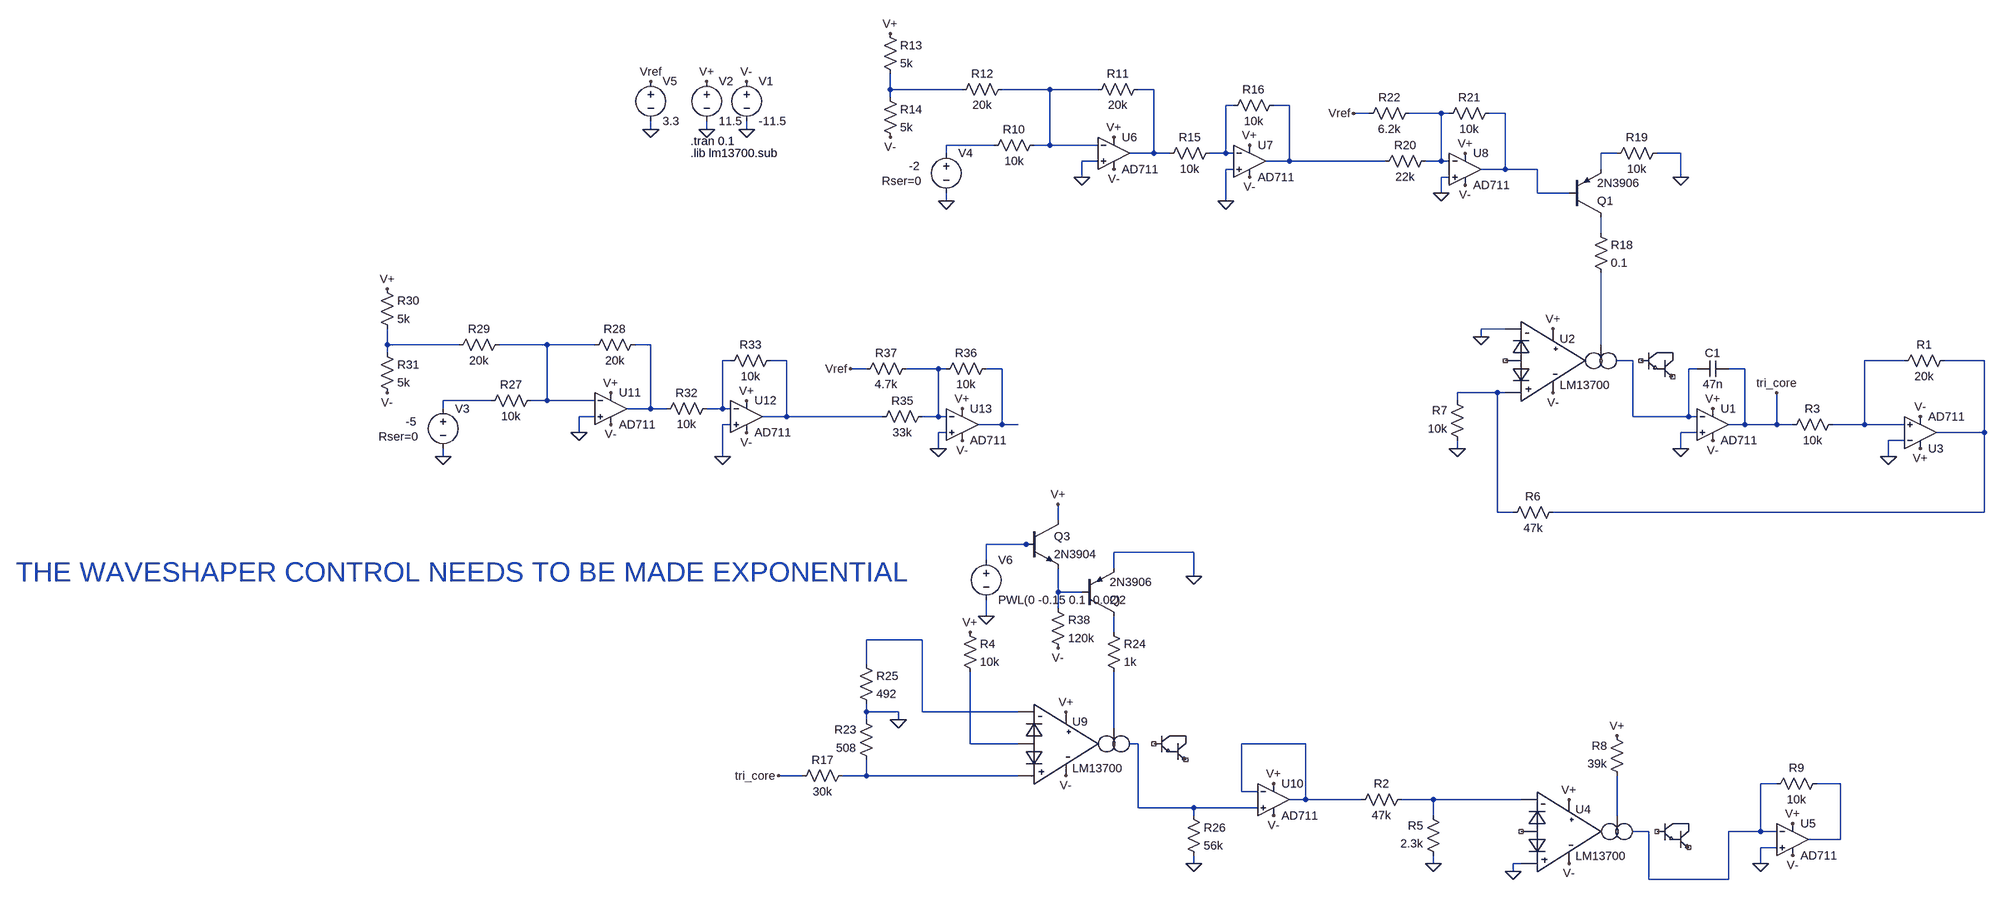
[diagram p0: schematic osc_core.asc]
osc_core.asc, the LTspice schematic file:
Version 4
SHEET 1 1972 1396
WIRE -1632 -448 -1632 -480
WIRE -1488 -448 -1632 -448
WIRE -1312 -448 -1408 -448
WIRE -1216 -448 -1312 -448
WIRE -1104 -448 -1136 -448
WIRE -1632 -432 -1632 -448
WIRE -944 -416 -960 -416
WIRE -832 -416 -864 -416
WIRE -672 -400 -704 -400
WIRE -528 -400 -592 -400
WIRE -512 -400 -528 -400
WIRE -400 -400 -432 -400
WIRE -2112 -368 -2112 -384
WIRE -2000 -368 -2000 -384
WIRE -1920 -368 -1920 -384
WIRE -1424 -336 -1520 -336
WIRE -1312 -336 -1312 -448
WIRE -1312 -336 -1344 -336
WIRE -1216 -336 -1312 -336
WIRE -1520 -320 -1520 -336
WIRE -1104 -320 -1104 -448
WIRE -1104 -320 -1152 -320
WIRE -1072 -320 -1104 -320
WIRE -960 -320 -960 -416
WIRE -960 -320 -992 -320
WIRE -944 -320 -960 -320
WIRE -176 -320 -208 -320
WIRE -48 -320 -96 -320
WIRE -1216 -304 -1248 -304
WIRE -832 -304 -832 -416
WIRE -832 -304 -880 -304
WIRE -640 -304 -832 -304
WIRE -528 -304 -528 -400
WIRE -528 -304 -560 -304
WIRE -512 -304 -528 -304
WIRE -944 -288 -960 -288
WIRE -400 -288 -400 -400
WIRE -400 -288 -448 -288
WIRE -336 -288 -400 -288
WIRE -208 -288 -208 -320
WIRE -1248 -272 -1248 -304
WIRE -512 -272 -528 -272
WIRE -48 -272 -48 -320
WIRE -528 -240 -528 -272
WIRE -336 -240 -336 -288
WIRE -272 -240 -336 -240
WIRE -1520 -224 -1520 -240
WIRE -960 -224 -960 -288
WIRE -208 -160 -208 -192
WIRE -400 32 -448 32
WIRE -448 48 -448 32
WIRE -2640 64 -2640 32
WIRE -2496 64 -2640 64
WIRE -2320 64 -2416 64
WIRE -2224 64 -2320 64
WIRE -2112 64 -2144 64
WIRE -208 64 -208 -80
WIRE -2640 80 -2640 64
WIRE -1952 96 -1968 96
WIRE -1840 96 -1872 96
WIRE -144 96 -176 96
WIRE 400 96 320 96
WIRE 560 96 480 96
WIRE -1680 112 -1712 112
WIRE -1536 112 -1600 112
WIRE -1520 112 -1536 112
WIRE -1408 112 -1440 112
WIRE -16 112 -32 112
WIRE 80 112 48 112
WIRE -416 160 -496 160
WIRE -400 160 -416 160
WIRE -2432 176 -2528 176
WIRE -2320 176 -2320 64
WIRE -2320 176 -2352 176
WIRE -2224 176 -2320 176
WIRE -496 176 -496 160
WIRE -2528 192 -2528 176
WIRE -2112 192 -2112 64
WIRE -2112 192 -2160 192
WIRE -2080 192 -2112 192
WIRE -1968 192 -1968 96
WIRE -1968 192 -2000 192
WIRE -1952 192 -1968 192
WIRE -2224 208 -2256 208
WIRE -1840 208 -1840 96
WIRE -1840 208 -1888 208
WIRE -1648 208 -1840 208
WIRE -1536 208 -1536 112
WIRE -1536 208 -1568 208
WIRE -1520 208 -1536 208
WIRE -144 208 -144 96
WIRE -32 208 -32 112
WIRE -32 208 -144 208
WIRE -16 208 -32 208
WIRE -1952 224 -1968 224
WIRE -1408 224 -1408 112
WIRE -1408 224 -1456 224
WIRE -1376 224 -1408 224
WIRE 80 224 80 112
WIRE 80 224 48 224
WIRE 144 224 144 160
WIRE 144 224 80 224
WIRE 176 224 144 224
WIRE 320 224 320 96
WIRE 320 224 256 224
WIRE 400 224 320 224
WIRE -2256 240 -2256 208
WIRE -1520 240 -1536 240
WIRE -16 240 -48 240
WIRE 560 240 560 96
WIRE 560 240 464 240
WIRE 400 256 368 256
WIRE -1536 272 -1536 240
WIRE -496 272 -496 256
WIRE -48 272 -48 240
WIRE -2528 288 -2528 272
WIRE -1968 288 -1968 224
WIRE 368 288 368 256
WIRE -416 400 -416 160
WIRE -384 400 -416 400
WIRE 560 400 560 240
WIRE 560 400 -304 400
WIRE -1296 416 -1296 384
WIRE -1360 464 -1440 464
WIRE -1344 464 -1360 464
WIRE -1024 480 -1184 480
WIRE -1440 496 -1440 464
WIRE -1184 512 -1184 480
WIRE -1024 528 -1024 480
WIRE -1296 560 -1296 512
WIRE -1248 560 -1296 560
WIRE -1296 592 -1296 560
WIRE -1440 608 -1440 576
WIRE -1184 640 -1184 608
WIRE -1568 656 -1680 656
WIRE -1680 704 -1680 656
WIRE -1680 800 -1680 784
WIRE -1616 800 -1680 800
WIRE -1568 800 -1568 656
WIRE -1376 800 -1568 800
WIRE -1680 816 -1680 800
WIRE -1616 816 -1616 800
WIRE -1184 832 -1184 720
WIRE -1472 864 -1472 720
WIRE -1376 864 -1472 864
WIRE -1136 864 -1152 864
WIRE -800 864 -928 864
WIRE -1808 928 -1856 928
WIRE -1680 928 -1680 896
WIRE -1680 928 -1728 928
WIRE -1376 928 -1680 928
WIRE 144 944 112 944
WIRE 272 944 224 944
WIRE -928 960 -928 864
WIRE -896 960 -928 960
WIRE -800 976 -800 864
WIRE -800 976 -832 976
WIRE -688 976 -800 976
WIRE -544 976 -608 976
WIRE -368 976 -544 976
WIRE -1136 992 -1136 864
WIRE -1024 992 -1136 992
WIRE -896 992 -1024 992
WIRE -1024 1008 -1024 992
WIRE -544 1008 -544 976
WIRE -176 1008 -176 928
WIRE -112 1040 -144 1040
WIRE 112 1040 112 944
WIRE 112 1040 48 1040
WIRE 144 1040 112 1040
WIRE 272 1056 272 944
WIRE 272 1056 208 1056
WIRE 144 1072 112 1072
WIRE -1024 1104 -1024 1088
WIRE -544 1104 -544 1088
WIRE -368 1104 -384 1104
WIRE 112 1104 112 1072
WIRE -384 1120 -384 1104
WIRE -112 1136 -112 1040
WIRE 48 1136 48 1040
WIRE 48 1136 -112 1136
FLAG -1920 -368 0
FLAG -2000 -368 0
FLAG -2000 -464 V+
FLAG 432 272 V+
FLAG -1920 -464 V-
FLAG 432 208 V-
FLAG -304 32 V+
FLAG -304 160 V-
FLAG -448 48 0
FLAG 368 288 0
FLAG 16 192 V+
FLAG 16 256 V-
FLAG -48 272 0
FLAG -496 272 0
FLAG 144 160 tri_core
FLAG -176 848 V+
FLAG -272 1104 V-
FLAG -272 976 V+
FLAG 176 1088 V-
FLAG 176 1024 V+
FLAG 112 1104 0
FLAG -384 1120 0
FLAG -1520 -224 0
FLAG -1184 -352 V+
FLAG -1184 -288 V-
FLAG -1248 -272 0
FLAG -1632 -352 V-
FLAG -1632 -560 V+
FLAG -912 -336 V+
FLAG -912 -272 V-
FLAG -960 -224 0
FLAG -48 -272 0
FLAG -480 -320 V+
FLAG -480 -256 V-
FLAG -528 -240 0
FLAG -704 -400 Vref
FLAG -2112 -368 0
FLAG -2112 -464 Vref
FLAG -1280 800 V+
FLAG -1280 928 V-
FLAG -1472 640 V+
FLAG -1616 816 0
FLAG -864 944 V+
FLAG -864 1008 V-
FLAG -1024 1104 0
FLAG -1856 928 tri_core
FLAG -2528 288 0
FLAG -2192 160 V+
FLAG -2192 224 V-
FLAG -2256 240 0
FLAG -2640 160 V-
FLAG -2640 -48 V+
FLAG -1920 176 V+
FLAG -1920 240 V-
FLAG -1968 288 0
FLAG -1024 528 0
FLAG -1488 192 V+
FLAG -1488 256 V-
FLAG -1536 272 0
FLAG -1712 112 Vref
FLAG -544 1104 0
FLAG -1296 384 V+
FLAG -1440 608 0
FLAG -1296 672 V-
SYMBOL voltage -1920 -480 R0
WINDOW 123 0 0 Left 0
WINDOW 39 0 0 Left 0
SYMATTR InstName V1
SYMATTR Value -11.5
SYMBOL voltage -2000 -480 R0
WINDOW 123 0 0 Left 0
WINDOW 39 0 0 Left 0
SYMATTR InstName V2
SYMATTR Value 11.5
SYMBOL LM13700 -336 16 R0
SYMATTR InstName U2
SYMBOL res 496 80 R90
WINDOW 0 0 56 VBottom 2
WINDOW 3 32 56 VTop 2
SYMATTR InstName R1
SYMATTR Value 20k
SYMBOL cap 48 96 R90
WINDOW 0 0 32 VBottom 2
WINDOW 3 32 32 VTop 2
SYMATTR InstName C1
SYMATTR Value 47n
SYMBOL res 272 208 R90
WINDOW 0 0 56 VBottom 2
WINDOW 3 32 56 VTop 2
SYMATTR InstName R3
SYMATTR Value 10k
SYMBOL res -288 384 R90
WINDOW 0 0 56 VBottom 2
WINDOW 3 32 56 VTop 2
SYMATTR InstName R6
SYMATTR Value 47k
SYMBOL res -480 272 R180
WINDOW 0 36 76 Left 2
WINDOW 3 36 40 Left 2
SYMATTR InstName R7
SYMATTR Value 10k
SYMBOL OpAmps\\AD711 16 160 R0
SYMATTR InstName U1
SYMBOL OpAmps\\AD711 432 304 M180
SYMATTR InstName U3
SYMBOL LM13700 -304 960 R0
SYMATTR InstName U4
SYMBOL res -592 960 R90
WINDOW 0 0 56 VBottom 2
WINDOW 3 32 56 VTop 2
SYMATTR InstName R2
SYMATTR Value 47k
SYMBOL res -528 1104 R180
WINDOW 0 36 76 Left 2
WINDOW 3 36 40 Left 2
SYMATTR InstName R5
SYMATTR Value 2.3k
SYMBOL res -160 944 R180
WINDOW 0 36 76 Left 2
WINDOW 3 36 40 Left 2
SYMATTR InstName R8
SYMATTR Value 39k
SYMBOL res 240 928 R90
WINDOW 0 0 56 VBottom 2
WINDOW 3 32 56 VTop 2
SYMATTR InstName R9
SYMATTR Value 10k
SYMBOL OpAmps\\AD711 176 992 R0
SYMATTR InstName U5
SYMBOL Opamps\\AD711 -1184 -384 R0
SYMATTR InstName U6
SYMBOL res -1328 -352 R90
WINDOW 0 0 56 VBottom 2
WINDOW 3 32 56 VTop 2
SYMATTR InstName R10
SYMATTR Value 10k
SYMBOL res -1120 -464 R90
WINDOW 0 0 56 VBottom 2
WINDOW 3 32 56 VTop 2
SYMATTR InstName R11
SYMATTR Value 20k
SYMBOL voltage -1520 -336 R0
WINDOW 123 0 0 Left 0
WINDOW 39 -129 72 Left 2
WINDOW 3 -75 42 Left 2
SYMATTR SpiceLine Rser=0
SYMATTR Value -2
SYMATTR InstName V4
SYMBOL res -1392 -464 R90
WINDOW 0 0 56 VBottom 2
WINDOW 3 32 56 VTop 2
SYMATTR InstName R12
SYMATTR Value 20k
SYMBOL res -1648 -576 R0
SYMATTR InstName R13
SYMATTR Value 5k
SYMBOL res -1648 -448 R0
SYMATTR InstName R14
SYMATTR Value 5k
SYMBOL Opamps\\AD711 -912 -368 R0
SYMATTR InstName U7
SYMBOL res -976 -336 R90
WINDOW 0 0 56 VBottom 2
WINDOW 3 32 56 VTop 2
SYMATTR InstName R15
SYMATTR Value 10k
SYMBOL res -848 -432 R90
WINDOW 0 0 56 VBottom 2
WINDOW 3 32 56 VTop 2
SYMATTR InstName R16
SYMATTR Value 10k
SYMBOL res -224 -176 R0
SYMATTR InstName R18
SYMATTR Value 0.1
SYMBOL pnp -272 -192 M180
SYMATTR InstName Q1
SYMATTR Value 2N3906
SYMBOL res -80 -336 R90
WINDOW 0 0 56 VBottom 2
WINDOW 3 32 56 VTop 2
SYMATTR InstName R19
SYMATTR Value 10k
SYMBOL Opamps\\AD711 -480 -352 R0
SYMATTR InstName U8
SYMBOL res -544 -320 R90
WINDOW 0 0 56 VBottom 2
WINDOW 3 32 56 VTop 2
SYMATTR InstName R20
SYMATTR Value 22k
SYMBOL res -416 -416 R90
WINDOW 0 0 56 VBottom 2
WINDOW 3 32 56 VTop 2
SYMATTR InstName R21
SYMATTR Value 10k
SYMBOL res -576 -416 R90
WINDOW 0 0 56 VBottom 2
WINDOW 3 32 56 VTop 2
SYMATTR InstName R22
SYMATTR Value 6.2k
SYMBOL voltage -2112 -480 R0
WINDOW 123 0 0 Left 0
WINDOW 39 0 0 Left 0
SYMATTR InstName V5
SYMATTR Value 3.3
SYMBOL LM13700 -1312 784 R0
SYMATTR InstName U9
SYMBOL res -1488 624 R0
SYMATTR InstName R4
SYMATTR Value 10k
SYMBOL res -1712 912 R90
WINDOW 0 0 56 VBottom 2
WINDOW 3 32 56 VTop 2
SYMATTR InstName R17
SYMATTR Value 30k
SYMBOL res -1664 912 R180
WINDOW 0 36 76 Left 2
WINDOW 3 36 40 Left 2
SYMATTR InstName R23
SYMATTR Value 508
SYMBOL res -1200 624 R0
SYMATTR InstName R24
SYMATTR Value 1k
SYMBOL res -1696 688 R0
SYMATTR InstName R25
SYMATTR Value 492
SYMBOL Opamps\\AD711 -864 912 R0
SYMATTR InstName U10
SYMBOL res -1040 992 R0
SYMATTR InstName R26
SYMATTR Value 56k
SYMBOL Opamps\\AD711 -2192 128 R0
SYMATTR InstName U11
SYMBOL res -2336 160 R90
WINDOW 0 0 56 VBottom 2
WINDOW 3 32 56 VTop 2
SYMATTR InstName R27
SYMATTR Value 10k
SYMBOL res -2128 48 R90
WINDOW 0 0 56 VBottom 2
WINDOW 3 32 56 VTop 2
SYMATTR InstName R28
SYMATTR Value 20k
SYMBOL voltage -2528 176 R0
WINDOW 123 0 0 Left 0
WINDOW 39 -129 72 Left 2
WINDOW 3 -75 42 Left 2
SYMATTR SpiceLine Rser=0
SYMATTR Value -5
SYMATTR InstName V3
SYMBOL res -2400 48 R90
WINDOW 0 0 56 VBottom 2
WINDOW 3 32 56 VTop 2
SYMATTR InstName R29
SYMATTR Value 20k
SYMBOL res -2656 -64 R0
SYMATTR InstName R30
SYMATTR Value 5k
SYMBOL res -2656 64 R0
SYMATTR InstName R31
SYMATTR Value 5k
SYMBOL Opamps\\AD711 -1920 144 R0
SYMATTR InstName U12
SYMBOL res -1984 176 R90
WINDOW 0 0 56 VBottom 2
WINDOW 3 32 56 VTop 2
SYMATTR InstName R32
SYMATTR Value 10k
SYMBOL res -1856 80 R90
WINDOW 0 0 56 VBottom 2
WINDOW 3 32 56 VTop 2
SYMATTR InstName R33
SYMATTR Value 10k
SYMBOL pnp -1248 608 M180
SYMATTR InstName Q2
SYMATTR Value 2N3906
SYMBOL Opamps\\AD711 -1488 160 R0
SYMATTR InstName U13
SYMBOL res -1552 192 R90
WINDOW 0 0 56 VBottom 2
WINDOW 3 32 56 VTop 2
SYMATTR InstName R35
SYMATTR Value 33k
SYMBOL res -1424 96 R90
WINDOW 0 0 56 VBottom 2
WINDOW 3 32 56 VTop 2
SYMATTR InstName R36
SYMATTR Value 10k
SYMBOL res -1584 96 R90
WINDOW 0 0 56 VBottom 2
WINDOW 3 32 56 VTop 2
SYMATTR InstName R37
SYMATTR Value 4.7k
SYMBOL npn -1360 416 R0
SYMATTR InstName Q3
SYMATTR Value 2N3904
SYMBOL res -1312 576 R0
SYMATTR InstName R38
SYMATTR Value 120k
SYMBOL voltage -1440 480 R0
WINDOW 123 0 0 Left 0
WINDOW 39 0 0 Left 0
SYMATTR InstName V6
SYMATTR Value PWL(0 -0.15 0.1 -0.02)
TEXT -2032 -344 Left 2 !.tran 0.1
TEXT -2032 -320 Left 2 !.lib lm13700.sub
TEXT -3384 520 Left 5 ;THE WAVESHAPER CONTROL NEEDS TO BE MADE EXPONENTIAL

The netlist it stands for:
* osc_core.asc
V1 V- 0 -11.5
V2 V+ 0 11.5
XU2 NC_01 N022 0 N014 N017 V+ V- NC_02 NC_03 LM13700 HALF13700  ; pins LIN INP INN IAB ? VCC VSS BIN BUF
R1 N019 N018 20k
C1 tri_core N017 47n
R3 N018 tri_core 10k
R6 N019 N022 47k
R7 0 N022 10k
XU1 0 N017 V+ V- tri_core AD712  ; AD711, pins In+ In- V+ V- OUT
XU3 N018 0 V+ V- N019 AD712  ; AD711, pins In+ In- V+ V- OUT
XU4 NC_04 0 N035 N036 N033 V+ V- NC_05 NC_06 LM13700 HALF13700  ; pins LIN INP INN IAB ? VCC VSS BIN BUF
R2 N035 N031 47k
R5 0 N035 2.3k
R8 N036 V+ 39k
R9 N034 N033 10k
XU5 0 N033 V+ V- N034 AD712  ; AD711, pins In+ In- V+ V- OUT
XU6 0 N002 V+ V- N003 AD712  ; AD711, pins In+ In- V+ V- OUT
R10 N002 N008 10k
R11 N003 N002 20k
V4 N008 0 -2 Rser=0
R12 N002 N001 20k
R13 V+ N001 5k
R14 N001 V- 5k
XU7 0 N004 V+ V- N005 AD712  ; AD711, pins In+ In- V+ V- OUT
R15 N004 N003 10k
R16 N005 N004 10k
R18 N010 N014 0.1
Q1 N010 N007 N009 0 2N3906
R19 0 N009 10k
XU8 0 N006 V+ V- N007 AD712  ; AD711, pins In+ In- V+ V- OUT
R20 N006 N005 22k
R21 N007 N006 10k
R22 N006 Vref 6.2k
V5 Vref 0 3.3
XU9 N029 N032 N027 N028 N030 V+ V- NC_07 NC_08 LM13700 HALF13700  ; pins LIN INP INN IAB ? VCC VSS BIN BUF
R4 V+ N029 10k
R17 N032 tri_core 30k
R23 N032 0 508
R24 N026 N028 1k
R25 N027 0 492
XU10 N030 N031 V+ V- N031 AD712  ; AD711, pins In+ In- V+ V- OUT
R26 N030 0 56k
XU11 0 N012 V+ V- N013 AD712  ; AD711, pins In+ In- V+ V- OUT
R27 N012 N023 10k
R28 N013 N012 20k
V3 N023 0 -5 Rser=0
R29 N012 N011 20k
R30 V+ N011 5k
R31 N011 V- 5k
XU12 0 N015 V+ V- N016 AD712  ; AD711, pins In+ In- V+ V- OUT
R32 N015 N013 10k
R33 N016 N015 10k
Q2 N026 N025 0 0 2N3906
XU13 0 N020 V+ V- N021 AD712  ; AD711, pins In+ In- V+ V- OUT
R35 N020 N016 33k
R36 N021 N020 10k
R37 N020 Vref 4.7k
Q3 V+ N024 N025 0 2N3904
R38 N025 V- 120k
V6 N024 0 PWL(0 -0.15 0.1 -0.02)
.model NPN NPN
.model PNP PNP
.lib standard.bjt
.tran 0.1
.lib lm13700.sub
* THE WAVESHAPER CONTROL NEEDS TO BE MADE EXPONENTIAL
.lib ADI1.lib
.backanno
.end